# Altium schematic sheet X322512MSB4SI1_X322512MSB4SI.schdoc.schdoc
size 127 x 101 mm
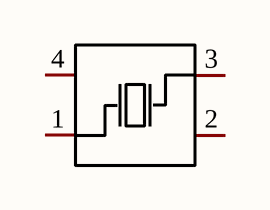
[diagram p0: X322512MSB4SI1_X322512MSB4SI.schdoc.schdoc]

## Parts
X?  X322512MSB4SI  [OSC-SMD_4P-L3.2-W2.5-BL]  (value not drawn)

## Nets

Not connected (* = marked no-connect by the designer): X? 1(OSC1) 2(GND) 3(OSC2) 4(GND)

## Library data of the parts
X? = X322512MSB4SI: Manufacturer: YXC(扬兴晶振); Add into BOM: yes; Crystal Type: 贴片晶振; Value: 12MHz; Normal temperature Frequency Tolerance: ±10ppm; Frequency Stability(Full temperature range): ±20ppm; Symbol: X322512MSB4SI; Device: X322512MSB4SI; LCSC Part Name: 12MHz ±10ppm 20pF; Supplier Part: C9002; Manufacturer Part: X322512MSB4SI; Supplier Footprint: SMD3225-4P; JLCPCB Part Class: Basic Part; Datasheet: https://atta.szlcsc.com/upload/public/pdf/source/20240329/19D5F850207469550BEB00D7DFEDBC7A.pdf; Supplier: LCSC; Convert to PCB: yes